# EAGLE schematic Team1_Wetterstation_v2_board2 (EAGLE 9.5.0)
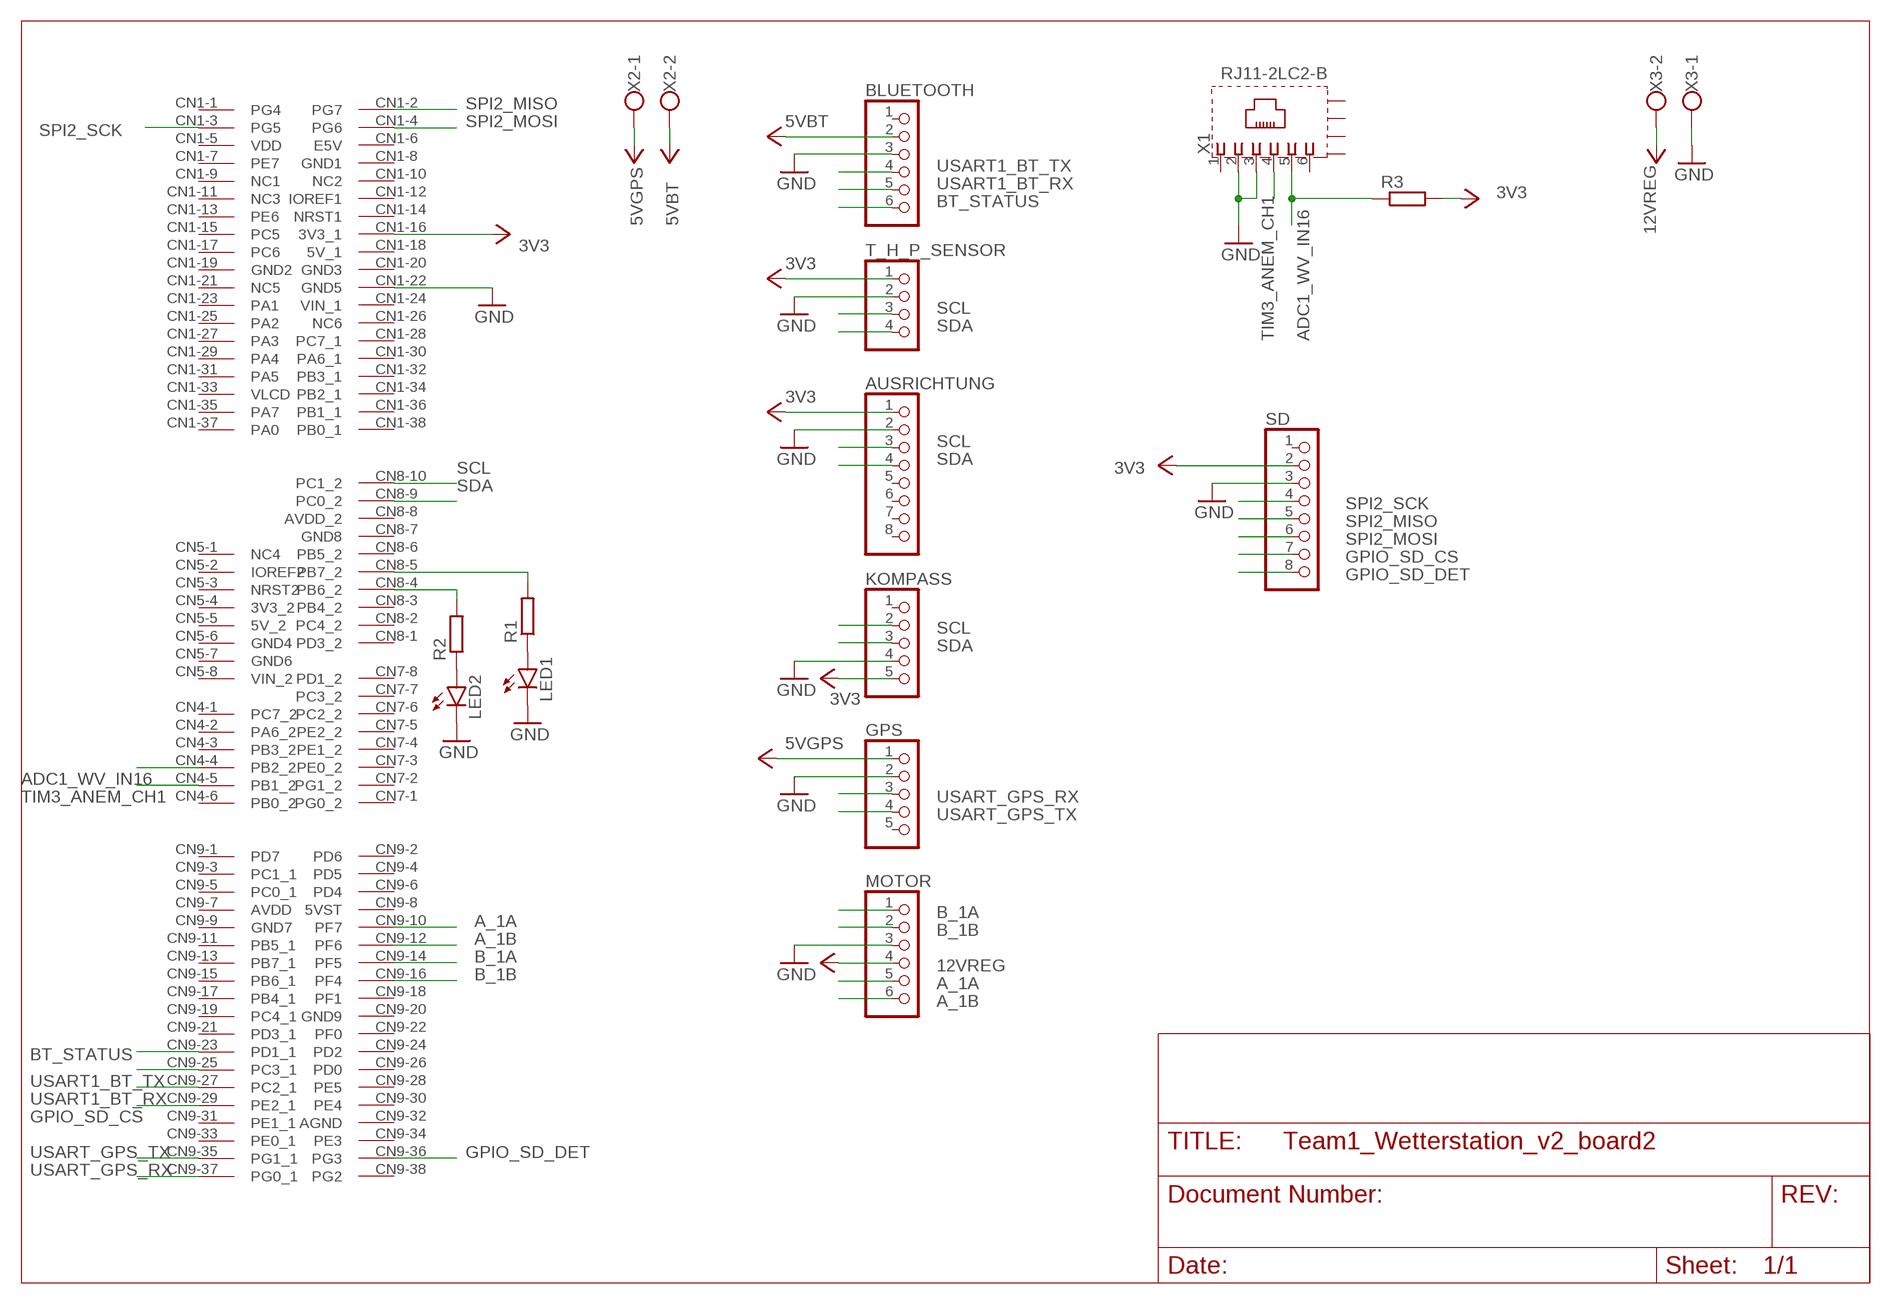
[diagram p0: schematic, sheet 1]

## Parts
AUSRICHTUNG  PINHD-1X8/90  [1X08/90]
BLUETOOTH  PINHD-1X6/90  [1X06/90]
GPS  PINHD-1X5/90  [1X05/90]
KOMPASS  PINHD-1X5/90  [1X05/90]
LED1  LED  [SMARTLED-TTW]
LED2  LED  [SMARTLED-TTW]
MOTOR  PINHD-1X6/90  [1X06/90]
R1  R-EU_R0603  [R0603]
R2  R-EU_R0603  [R0603]
R3  R-EU_R0603  [R0603]
SD  PINHD-1X8/90  [1X08/90]
T_H_P_SENSOR  PINHD-1X4/90  [1X04/90]
U$1  NUCLEO-8L152R8  [MODULE_NUCLEO-L053R8]
X1  RJ11-2LC2-B  [RJ11-SHIELD2]
X2  W237-102  [W237-102]
X3  W237-102  [W237-102]

## Nets
3V3: AUSRICHTUNG.1 KOMPASS.5 R3.2 SD.2 T_H_P_SENSOR.1 U$1.CN1-16(3V3_1) ; supply symbol labelled VCC
5VBT: BLUETOOTH.2 X2.2 ; supply symbol labelled VCC
5VGPS: GPS.1 X2.1 ; supply symbol labelled VCC
12VREG: MOTOR.4 X3.2 ; supply symbol labelled VCC
A_1A: MOTOR.5 U$1.CN9-10(PF7)
A_1B: MOTOR.6 U$1.CN9-12(PF6)
ADC1_WV_IN16: R3.1 U$1.CN4-4(PB2_2) X1.5
B_1A: MOTOR.1 U$1.CN9-14(PF5)
B_1B: MOTOR.2 U$1.CN9-16(PF4)
BT_STATUS: BLUETOOTH.6 U$1.CN9-23(PD1_1)
GND: AUSRICHTUNG.2 BLUETOOTH.3 GPS.2 KOMPASS.4 LED1.C@1(C) LED2.C@1(C) MOTOR.3 SD.3 T_H_P_SENSOR.2 U$1.CN1-22(GND5) X1.2 X1.3 X3.1
GPIO_SD_CS: SD.7 U$1.CN9-29(PE2_1)
GPIO_SD_DET: SD.8 U$1.CN9-36(PG3)
N$1: R1.2 U$1.CN8-5(PB7_2)
N$2: LED1.A@1(A) R1.1
N$3: R2.2 U$1.CN8-4(PB6_2)
N$4: LED2.A@1(A) R2.1
SCL: AUSRICHTUNG.3 KOMPASS.2 T_H_P_SENSOR.3 U$1.CN8-10(PC1_2)
SDA: AUSRICHTUNG.4 KOMPASS.3 T_H_P_SENSOR.4 U$1.CN8-9(PC0_2)
SPI2_MISO: SD.5 U$1.CN1-2(PG7)
SPI2_MOSI: SD.6 U$1.CN1-4(PG6)
SPI2_SCK: SD.4 U$1.CN1-3(PG5)
TIM3_ANEM_CH1: U$1.CN4-5(PB1_2) X1.4
USART1_BT_RX: BLUETOOTH.5 U$1.CN9-27(PC2_1)
USART1_BT_TX: BLUETOOTH.4 U$1.CN9-25(PC3_1)
USART_GPS_RX: GPS.3 U$1.CN9-37(PG0_1)
USART_GPS_TX: GPS.4 U$1.CN9-35(PG1_1)
Unconnected: AUSRICHTUNG.5 AUSRICHTUNG.6 AUSRICHTUNG.7 AUSRICHTUNG.8 BLUETOOTH.1 GPS.5 KOMPASS.1 SD.1 U$1.CN1-1(PG4) U$1.CN1-5(VDD) U$1.CN1-6(E5V) U$1.CN1-7(PE7) U$1.CN1-8(GND1) U$1.CN1-9(NC1) U$1.CN1-10(NC2) U$1.CN1-11(NC3) U$1.CN1-12(IOREF1) U$1.CN1-13(PE6) U$1.CN1-14(NRST1) U$1.CN1-15(PC5) U$1.CN1-17(PC6) U$1.CN1-18(5V_1) U$1.CN1-19(GND2) U$1.CN1-20(GND3) U$1.CN1-21(NC5) U$1.CN1-23(PA1) U$1.CN1-24(VIN_1) U$1.CN1-25(PA2) U$1.CN1-26(NC6) U$1.CN1-27(PA3) U$1.CN1-28(PC7_1) U$1.CN1-29(PA4) U$1.CN1-30(PA6_1) U$1.CN1-31(PA5) U$1.CN1-32(PB3_1) U$1.CN1-33(VLCD) U$1.CN1-34(PB2_1) U$1.CN1-35(PA7) U$1.CN1-36(PB1_1) U$1.CN1-37(PA0) U$1.CN1-38(PB0_1) U$1.CN4-1(PC7_2) U$1.CN4-2(PA6_2) U$1.CN4-3(PB3_2) U$1.CN4-6(PB0_2) U$1.CN5-1(NC4) U$1.CN5-2(IOREF2) U$1.CN5-3(NRST2) U$1.CN5-4(3V3_2) U$1.CN5-5(5V_2) U$1.CN5-6(GND4) U$1.CN5-7(GND6) U$1.CN5-8(VIN_2) U$1.CN7-1(PG0_2) U$1.CN7-2(PG1_2) U$1.CN7-3(PE0_2) U$1.CN7-4(PE1_2) U$1.CN7-5(PE2_2) U$1.CN7-6(PC2_2) U$1.CN7-7(PC3_2) U$1.CN7-8(PD1_2) U$1.CN8-1(PD3_2) U$1.CN8-2(PC4_2) U$1.CN8-3(PB4_2) U$1.CN8-6(PB5_2) U$1.CN8-7(GND8) U$1.CN8-8(AVDD_2) U$1.CN9-1(PD7) U$1.CN9-2(PD6) U$1.CN9-3(PC1_1) U$1.CN9-4(PD5) U$1.CN9-5(PC0_1) U$1.CN9-6(PD4) U$1.CN9-7(AVDD) U$1.CN9-8(5VST) U$1.CN9-9(GND7) U$1.CN9-11(PB5_1) U$1.CN9-13(PB7_1) U$1.CN9-15(PB6_1) U$1.CN9-17(PB4_1) U$1.CN9-18(PF1) U$1.CN9-19(PC4_1) U$1.CN9-20(GND9) U$1.CN9-21(PD3_1) U$1.CN9-22(PF0) U$1.CN9-24(PD2) U$1.CN9-26(PD0) U$1.CN9-28(PE5) U$1.CN9-30(PE4) U$1.CN9-31(PE1_1) U$1.CN9-32(AGND) U$1.CN9-33(PE0_1) U$1.CN9-34(PE3) U$1.CN9-38(PG2) X1.1 X1.6 X1.S1(S) X1.S2(S) X1.S3(S) X1.S4(S)

## Library data of the parts
AUSRICHTUNG SD = pinhead:PINHD-1X8: PIN HEADER
BLUETOOTH MOTOR = pinhead:PINHD-1X6: PIN HEADER
GPS KOMPASS = pinhead:PINHD-1X5: PIN HEADER
LED1 LED2 = led:LED: LED OSRAM: - CHIPLED LG R971, LG N971, LY N971, LG Q971, LY Q971, LO R971, LY R971 LH N974, LH R974 LS Q976, LO Q976, LY Q976 LO Q996 - Hyper CHIPLED LW Q18S LB Q993, LB Q99A, LB R99A - SideLED LS A670, LO A670, LY A670, LG A670, LP A670 LB A673, LV A673, LT A673, LW A673 LH A674 LY A675 LS A676, LA A676, LO A676, LY A676, LW A676 LS A679, LY A679, LG A679 - Hyper Micro SIDELED® LS Y876, LA Y876, LO Y876, LY Y876 LT Y87S - SmartLED LW L88C, LW L88S LB L89C, LB L89S, LG L890 LS L89K, LO L89K, LY L89K LS L896, LA L896, LO L896, LY L896 - TOPLED LS T670, LO T670, LY T670, LG T670, LP T670 LSG T670, LSP T670, LSY T670, LOP T670, LYG T670 LG T671, LOG T671, LSG T671 LB T673, LV T673, LT T673, LW T673 LH T674 LS T676, LA T676, LO T676, LY T676, LB T676, LH T676, LSB T676, LW T676 LB T67C, LV T67C, LT T67C, LS T67K, LO T67K, LY T67K, LW E67C LS E67B, LA E67B, LO E67B, LY E67B, LB E67C, LV E67C, LT E67C LW T67C LS T679, LY T679, LG T679 LS T770, LO T770, LY T770, LG T770, LP T770 LB T773, LV T773, LT T773, LW T773 LH T774 LS E675, LA E675, LY E675, LS T675 LS T776, LA T776, LO T776, LY T776, LB T776 LHGB T686 LT T68C, LB T68C - Hyper Mini TOPLED® LB M676 - Mini TOPLED Santana® LG M470 LS M47K, LO M47K, LY M47K Source: http://www.osram.convergy.de LUXEON: - LUMILED® LXK2-PW12-R00, LXK2-PW12-S00, LXK2-PW14-U00, LXK2-PW14-V00 LXK2-PM12-R00, LXK2-PM12-S00, LXK2-PM14-U00 LXK2-PE12-Q00, LXK2-PE12-R00, LXK2-PE12-S00, LXK2-PE14-T00, LXK2-PE14-U00 LXK2-PB12-K00, LXK2-PB12-L00, LXK2-PB12-M00, LXK2-PB14-N00, LXK2-PB14-P00, LXK2-PB14-Q00 LXK2-PR12-L00, LXK2-PR12-M00, LXK2-PR14-Q00, LXK2-PR14-R00 LXK2-PD12-Q00, LXK2-PD12-R00, LXK2-PD12-S00 LXK2-PH12-R00, LXK2-PH12-S00 LXK2-PL12-P00, LXK2-PL12-Q00, LXK2-PL12-R00 Source: www.luxeon.com KINGBRIGHT: KA-3528ASYC Source: www.kingbright.com
R1-R3 = rcl:R-EU_: RESISTOR, European symbol; SPICEPREFIX: R
T_H_P_SENSOR = pinhead:PINHD-1X4: PIN HEADER
U$1 = nucleo:NUCLEO-8L152R8
X1 = con-tycoelectronics:RJ11*2: RJ11 (Style 1 Shield / Style 2 Shield) Source: www.tycoelectronics.com .. ENG_DS_1654001_1099_RJ_L_0507.pdf; OC_FARNELL: unknown; OC_NEWARK: unknown
X2 X3 = con-wago-500:W237-102: WAGO SCREW CLAMP; MPN: 237-102; OC_FARNELL: unknown; OC_NEWARK: 70K9898